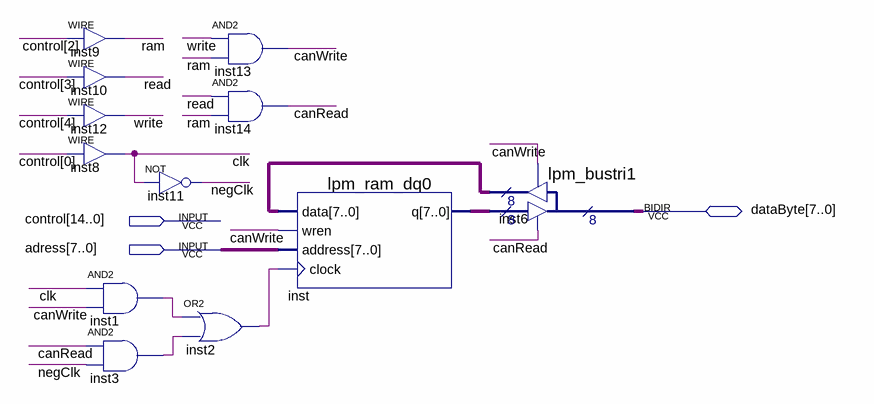
[diagram p0: schematic sheet]
// Quartus schematic Ram.bdf as structural Verilog: 12 symbols, 3 pins
module Ram (
  input  [14:0] control,
  input  [7:0] adress,
  inout  [7:0] dataByte
);

  wire canRead, canWrite, clk, inst1_out, inst2_out, inst3_out, negClk, ram, read, write;
  wire [7:0] inst6_result, inst_q;

  assign ram = control[2];  // WIRE inst9
  assign read = control[3];  // WIRE inst10
  assign write = control[4];  // WIRE inst12
  assign clk = control[0];  // WIRE inst8
  and inst1 (inst1_out, clk, canWrite);
  and inst3 (inst3_out, canRead, negClk);
  and inst13 (canWrite, write, ram);
  and inst14 (canRead, read, ram);
  not inst11 (negClk, clk);
  or inst2 (inst2_out, inst1_out, inst3_out);
  lpm_ram_dq0 inst (.data(inst6_result), .wren(canWrite), .address(adress), .clock(inst2_out), .q(inst_q));
  lpm_bustri1 inst6 (.enabledt(canRead), .data(inst_q), .enabletr(canWrite), .result(inst6_result), .tridata(dataByte));
endmodule
